# EAGLE design MotorBreakout (EAGLE 7.4.0)
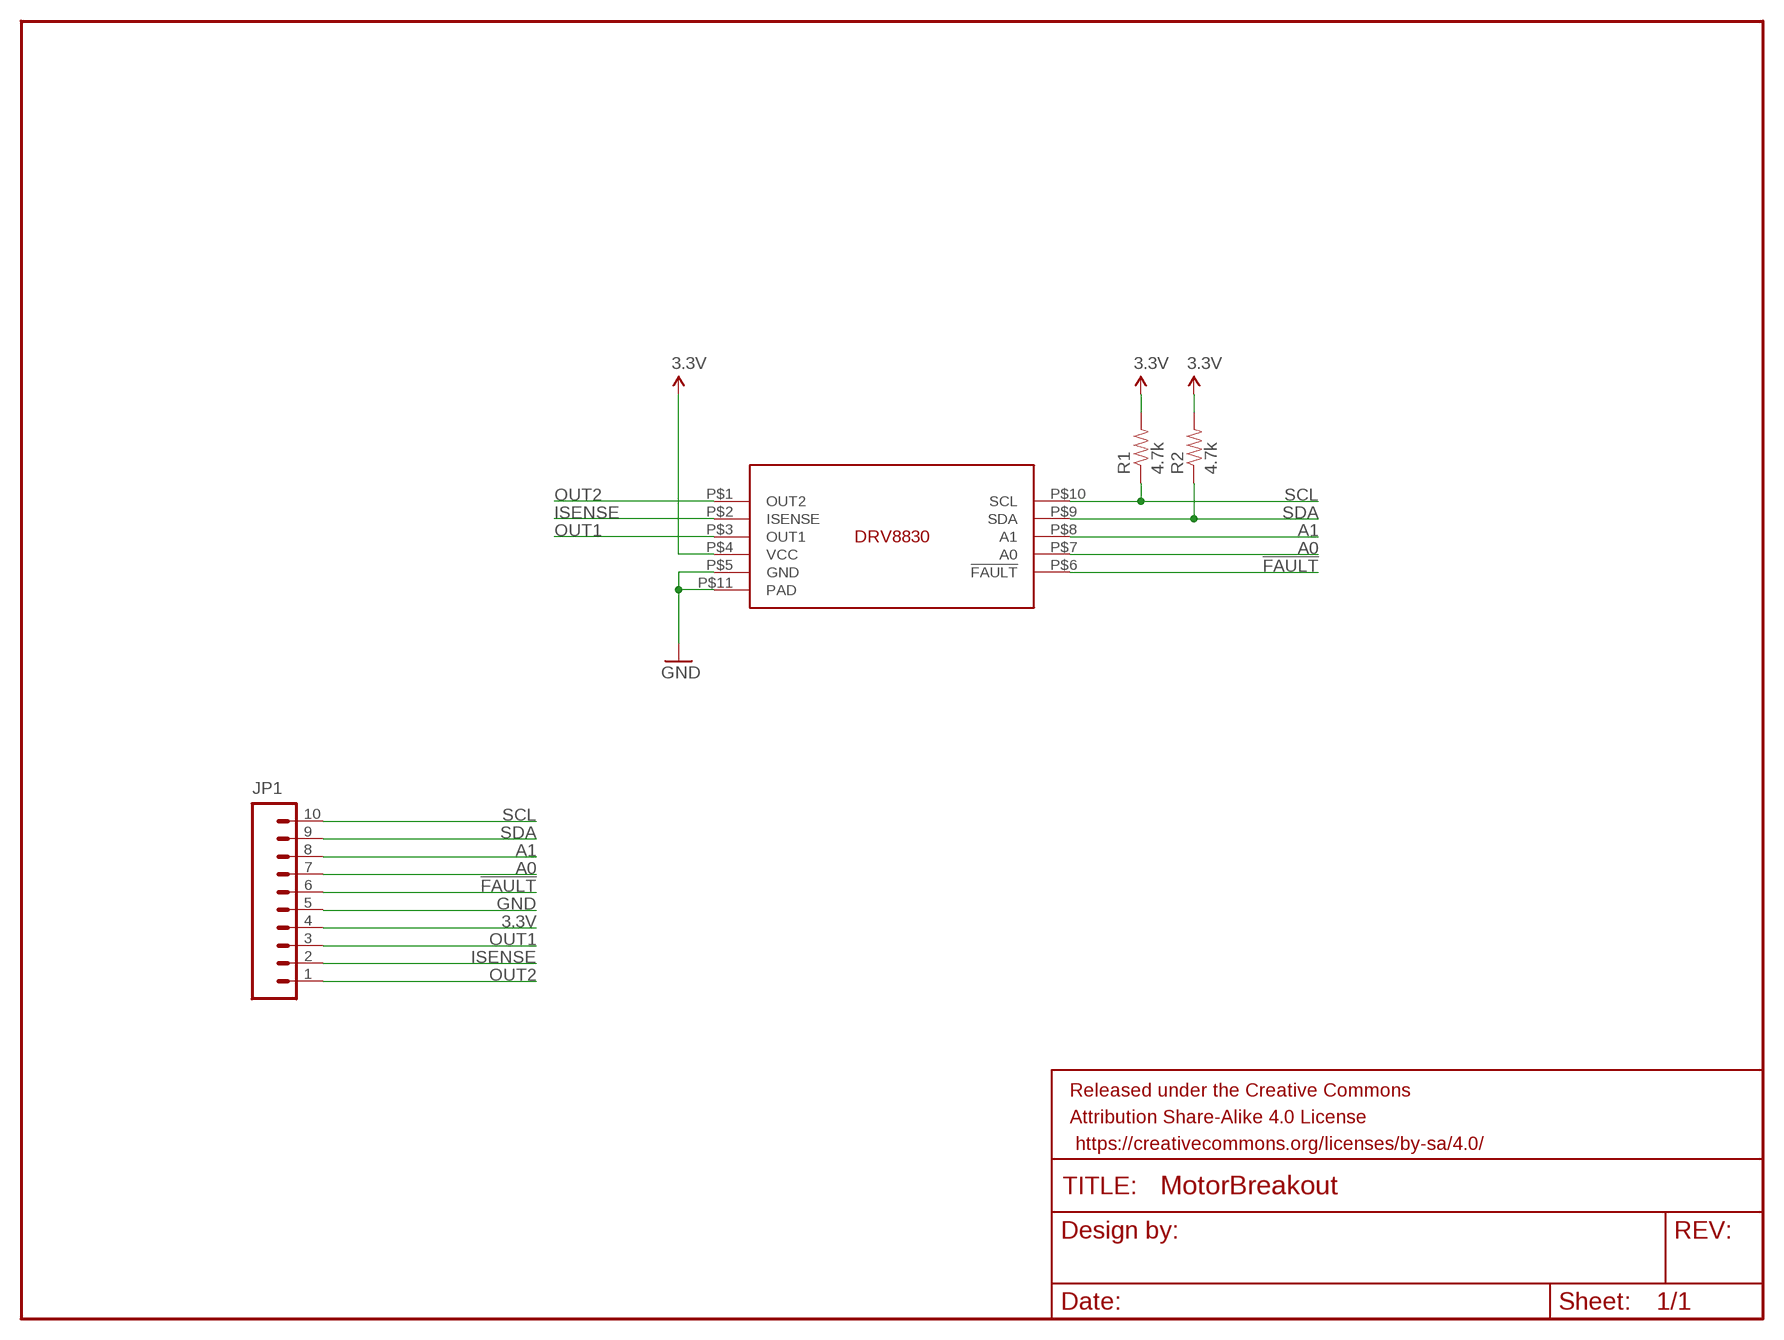
[diagram p0: schematic, sheet 1]

## Parts
FRAME1  FRAME-LETTERNO_PACKAGE  [DUMMY]
JP1  M10LOCK_LONGPADS  [1X10_LOCK_LONGPADS]
R1  4.7k  RESISTOR0402  [0402-RES]
R2  4.7k  RESISTOR0402  [0402-RES]
U$1  DRV8830  [DRV8830]

## Nets
3.3V: JP1.4 R1.2 R2.2 U$1.P$4(VCC)
!FAULT: JP1.6 U$1.P$6(!FAULT)
A0: JP1.7 U$1.P$7(A0)
A1: JP1.8 U$1.P$8(A1)
GND: JP1.5 U$1.P$5(GND) U$1.P$11(PAD)
ISENSE: JP1.2 U$1.P$2(ISENSE)
OUT1: JP1.3 U$1.P$3(OUT1)
OUT2: JP1.1 U$1.P$1(OUT2)
SCL: JP1.10 R1.1 U$1.P$10(SCL)
SDA: JP1.9 R2.1 U$1.P$9(SDA)

## Library data of the parts
FRAME1 = SparkFun-Aesthetics:FRAME-LETTER: Schematic Frame Standard 8.5x11 US Letter frame; DESIGNER: Nobody; VERSION: v01
JP1 = SparkFun-Connectors:M10: Header 10 Standard 10-pin 0.1" header. Use with straight break away headers (SKU : PRT-00116), right angle break away headers (PRT-00553), swiss pins (PRT-00743), machine pins (PRT-00117), and female headers (PRT-00115).
R1 R2 = SparkFun-Resistors:RESISTOR: Resistor Basic schematic elements and footprints for 0603, 1206, and PTH resistors.
U$1 = DRV8830:DRV8830

## Board
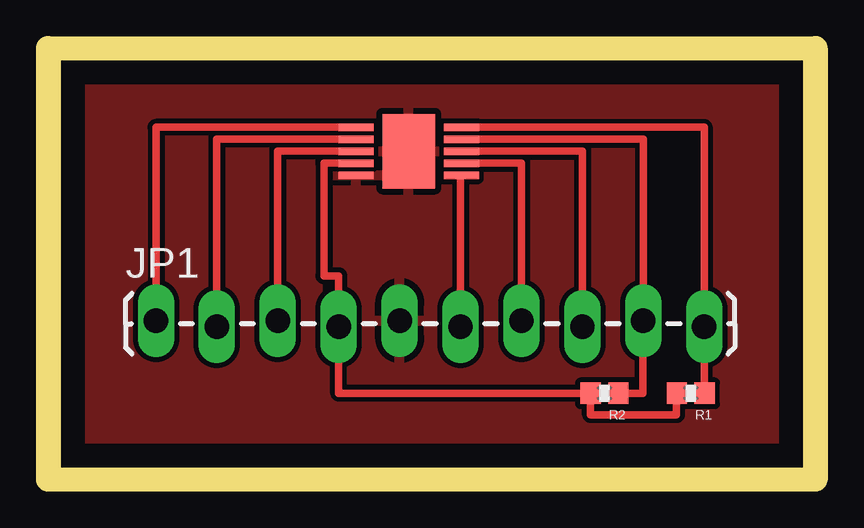
[diagram p1: board, top side]
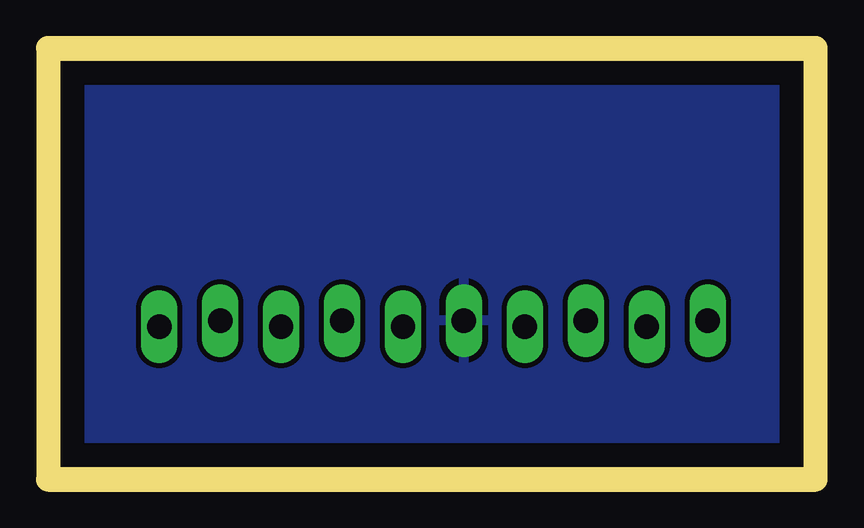
[diagram p2: board, bottom side, seen from below]

Size 31 x 17 mm. Coordinates in mm from the lower left corner, seen from the top.
Outline: 0,0 31,0 31,17 0,17 0,0
Copper layers (1*16): Top 0.035mm / dielectric 1.5mm / Bottom 0.035mm
Design rules "default": minimum track width 10mil, minimum drill 24mil, track to track 8mil, track to pad 8mil, pad to pad 8mil, via to via 8mil, smd to smd 8mil, copper to edge 40mil, drill to drill 8mil, minimum pad ring 10mil, minimum via ring 8mil, stop-mask expansion 4mil, vias tented up to drill 0mil, thermal gap 10mil
Milling: 4 lines

### Footprints (pad centres in the part's own frame; a part is rotated, then mirrored left to right if it is on the bottom)
1X10_LOCK_LONGPADS = drill 1.016 long: 1 0,0.127; 2 2.54,-0.127; 3 5.08,0.127; 4 7.62,-0.127; 5 10.16,0.127; 6 12.7,-0.127; 7 15.24,0.127; 8 17.78,-0.127; 9 20.32,0.127; 10 22.86,-0.127
0402-RES = smd 0.85 x 0.9: 1 -0.58,0; 2 0.58,0
DRV8830 = smd 1.45 x 0.3: P$1 -2.2,1; P$2 -2.2,0.5; P$3 -2.2,0; P$4 -2.2,-0.5; P$5 -2.2,-1; P$6 2.2,-1; P$7 2.2,-0.5; P$8 2.2,0; P$9 2.2,0.5; P$10 2.2,1 | smd 2.2 x 3.1: P$11 0,0

### Placement (x,y rotation side)
FRAME1  0,0 0 top
JP1  4,6 0 top
R1  26.3,3.1 180 top
R2  22.7,3.1 180 top
U$1  14.54,13.19 0 top

### Tracks (layer width: path | path; a pad name or v marks a point on that pad's centre or on a via)
3.3V
  Top 0.305: U$1.P$4 11,12.69 11,8 11.62,8 JP1.4 11.62,3.1 R2.2 22.12,2.2 25.7,2.2 25.7,3.1 R1.2
!FAULT
  Top 0.305: U$1.P$6 16.7,12.19 JP1.6
A0
  Top 0.305: U$1.P$7 19.24,12.69 JP1.7
A1
  Top 0.305: U$1.P$8 21.78,13.19 JP1.8
GND
  pour Bottom: 0,17 31,17 31,0 0,0
  pour Top: 0,17 31,17 31,0 0,0
ISENSE
  Top 0.305: U$1.P$2 6.54,13.69 JP1.2
OUT1
  Top 0.305: U$1.P$3 9.08,13.19 JP1.3
OUT2
  Top 0.305: U$1.P$1 4,14.19 JP1.1
SCL
  Top 0.305: U$1.P$10 26.86,14.19 JP1.10 26.86,3.1 R1.1
SDA
  Top 0.305: U$1.P$9 24.32,13.69 JP1.9 24.3,6.13 24.3,3.1 R2.1